# EAGLE design USB power term (EAGLE 7.3.0)
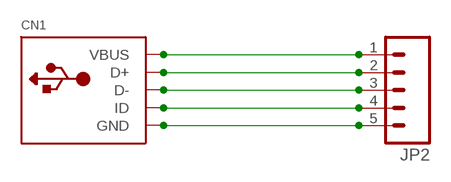
[diagram p0: schematic, sheet 1]

## Parts
CN1  USBMINIB  [USB-MINIB]
JP2  M05PTH_LONGPADS  [1X05_LONGPADS]

## Nets
N$1: CN1.GND JP2.5
N$2: CN1.ID JP2.4
N$3: CN1.D- JP2.3
N$4: CN1.D+ JP2.2
N$5: CN1.VBUS JP2.1

## Library data of the parts
CN1 = adafruit:USB: USB Connectors USBMINIB - Surface Mount Female Mini-B USB Connector 4UConnector: 06564 By microbuilder.eu Thru-hole RA Female Mini-B USB Connector 4UConnector: 18732 By ladyada.net
JP2 = SparkFun-Connectors:M05: Header 5 Standard 5-pin 0.1" header. Use with straight break away headers (SKU : PRT-00116), right angle break away headers (PRT-00553), swiss pins (PRT-00743), machine pins (PRT-00117), and female headers (PRT-00115). Molex polarized connector foot print use with SKU : PRT-08230 with associated crimp pins and housings.

## Board
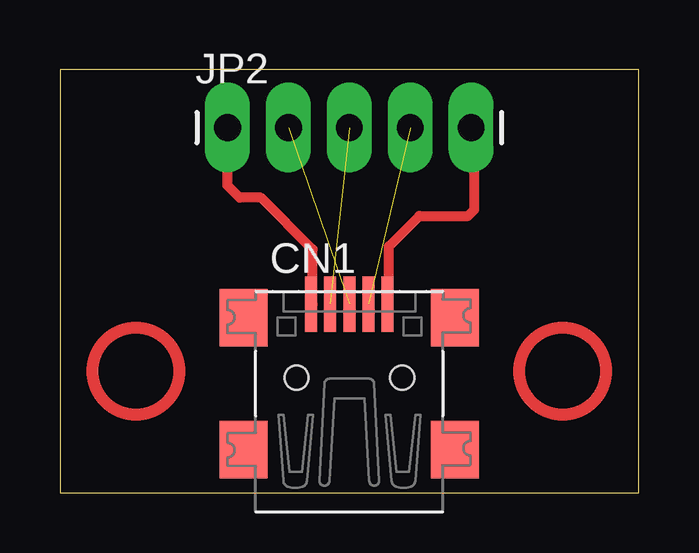
[diagram p1: board, top side]

Size 24.13 x 17.64 mm. Coordinates in mm from the lower left corner, seen from the top.
Outline: 0,0 24.13,0 24.13,17.64 0,17.64 0,0
Copper layers (1*16): Top 0.035mm / dielectric 1.5mm / Bottom 0.035mm
Design rules "default": minimum track width 10mil, minimum drill 24mil, track to track 8mil, track to pad 8mil, pad to pad 8mil, via to via 8mil, smd to smd 8mil, copper to edge 40mil, drill to drill 8mil, minimum pad ring 10mil, minimum via ring 8mil, stop-mask expansion 4mil, vias tented up to drill 0mil, thermal gap 10mil

### Footprints (pad centres in the part's own frame; a part is rotated, then mirrored left to right if it is on the bottom)
USB-MINIB = smd 0.5 x 2.308: D+ 0,4.064; D- -0.8,4.064; GND 1.6,4.064; ID 0.8,4.064; VBUS -1.6,4.064 | smd 2 x 2.4: GND1 -4.4,-2; GND2 -4.4,3.5; GND3 4.4,3.5; GND4 4.4,-2 | hole 1: -2.2,1; 2.2,1
1X05_LONGPADS = drill 1.118 pad 1.88 long: 1 0,0; 2 2.54,0; 3 5.08,0; 4 7.62,0; 5 10.16,0

### Placement (x,y rotation side)
CN1  12.06,3.81 0 top
JP2  6.99,15.24 0 top

### Tracks (layer width: path | path; a pad name or v marks a point on that pad's centre or on a via)
N$1
  Top 0.406: CN1.GND 13.72,7.92 13.72,10.29 14.99,11.56 17.02,11.56 17.27,11.81 17.27,13.97 17.14,14.1 JP2.5
N$2  (1 unrouted)
N$3  (1 unrouted)
N$4  (1 unrouted)
N$5
  Top 0.406: CN1.VBUS 10.54,7.87 10.54,10.16 8.38,12.32 7.49,12.32 6.99,12.83 JP2.1
(copper drawn outside any net)
  shapes: Top circle x2